# EAGLE design ESP32-C6_Qwiic_Micro (EAGLE 9.6.2)
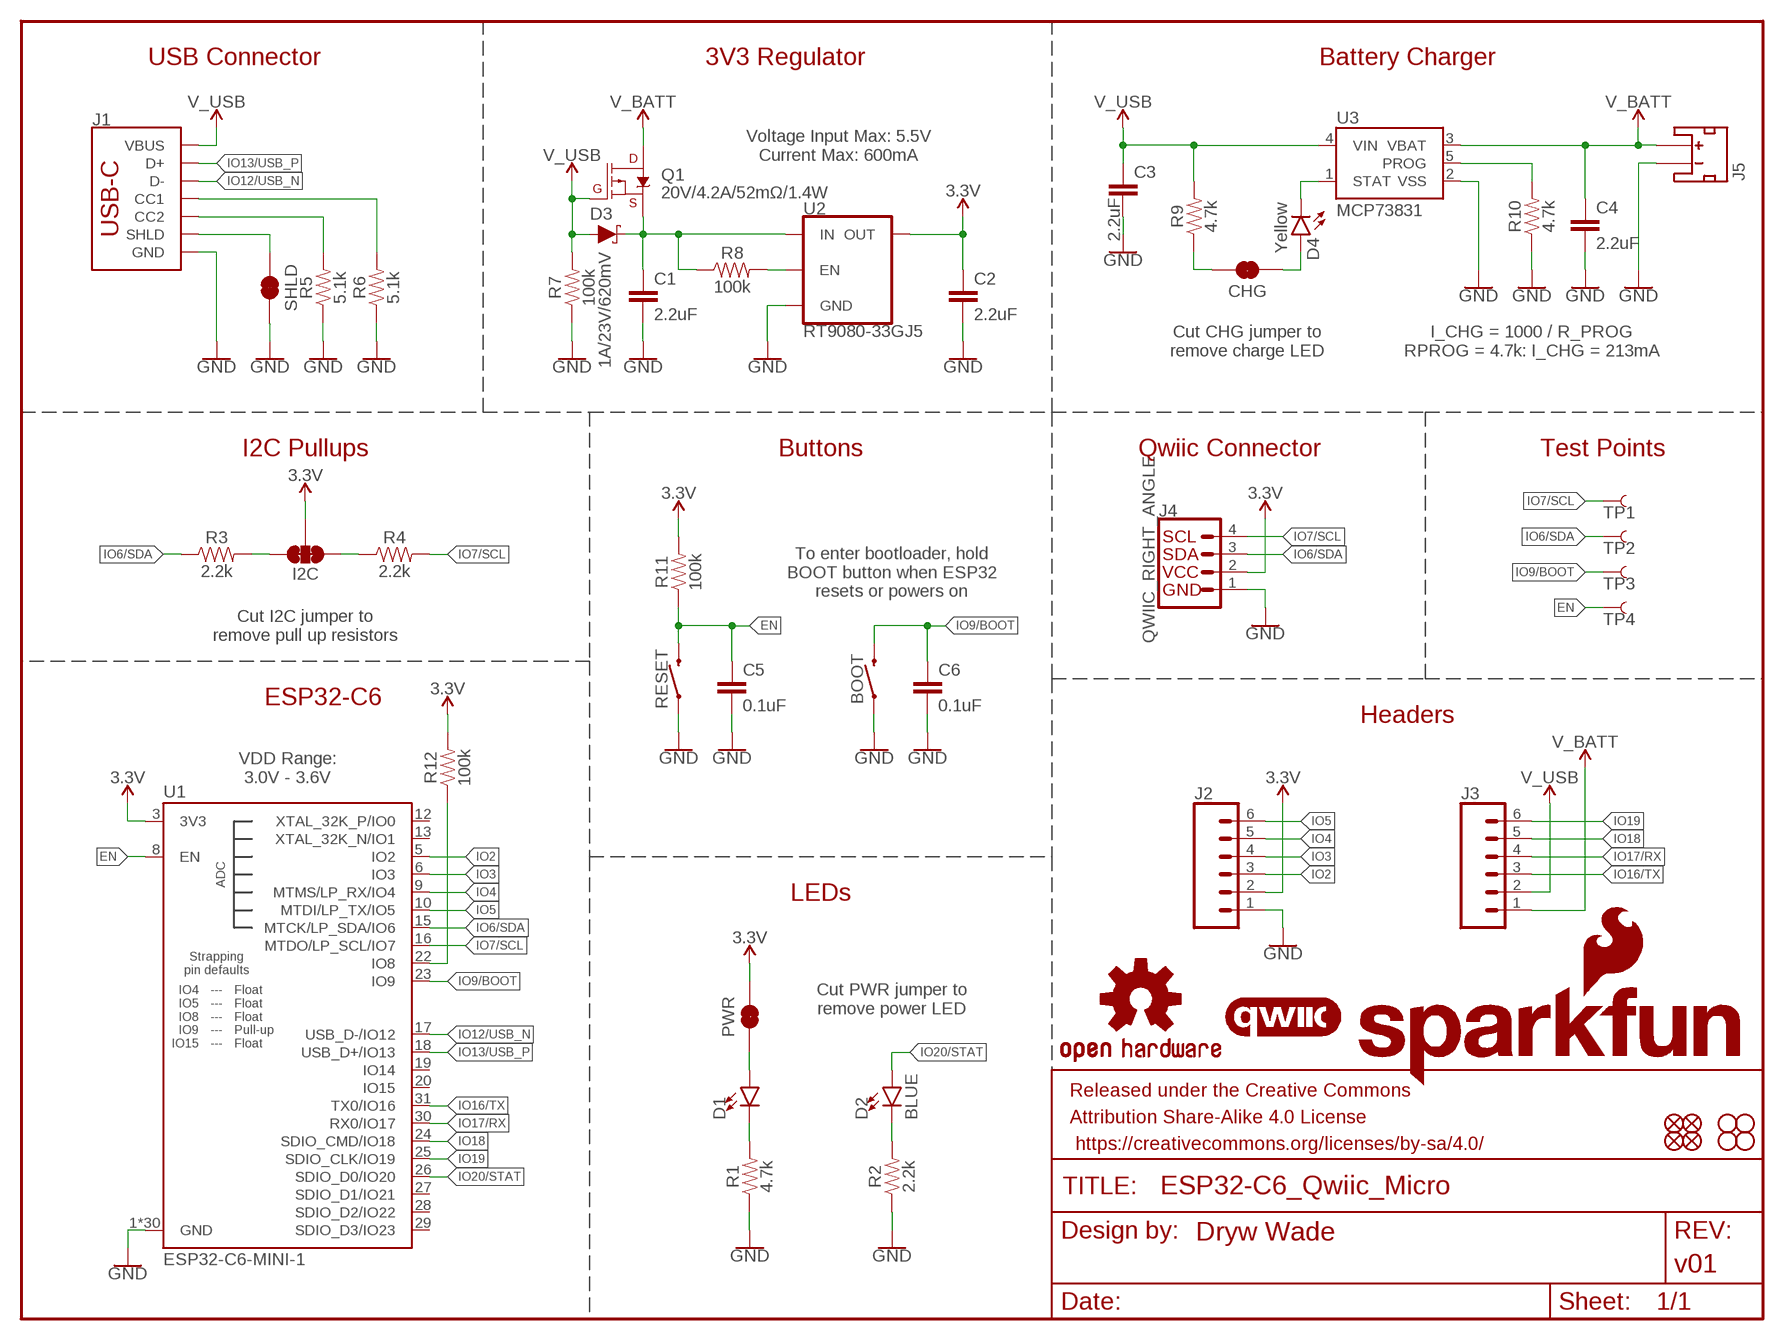
[diagram p0: schematic, sheet 1]

## Parts
BOOT  MOMENTARY-SWITCH-SPST-SMD-4.6X2.8MM  [TACTILE_SWITCH_SMD_4.6X2.8MM]
C1  2.2uF  2.2UF-0402_TIGHT-10V-10%-X5R  [0402-TIGHT]
C2  2.2uF  2.2UF-0402_TIGHT-10V-10%-X5R  [0402-TIGHT]
C3  2.2uF  2.2UF-0402_TIGHT-10V-10%-X5R  [0402-TIGHT]
C4  2.2uF  2.2UF-0402_TIGHT-10V-10%-X5R  [0402-TIGHT]
C5  0.1uF  0.1UF-0402T-6.3V-10%-X7R  [0402-TIGHT]
C6  0.1uF  0.1UF-0402T-6.3V-10%-X7R  [0402-TIGHT]
CHG  JUMPER-SMT_2_NC_TRACE_SILK  [SMT-JUMPER_2_NC_TRACE_SILK]
D1  LED-RED_0603-KB  [LED-0603]
D2  BLUE  LED-BLUE0603  [LED-0603]
D3  1A/23V/620mV  DIODE-SCHOTTKY-BAT20J  [SOD-323]
D4  Yellow  LED-YELLOW0603  [LED-0603]
FD1  FIDUCIALUFIDUCIAL  [FIDUCIAL-MICRO]
FD2  FIDUCIALUFIDUCIAL  [FIDUCIAL-MICRO]
FD3  FIDUCIALUFIDUCIAL  [FIDUCIAL-MICRO]
FD4  FIDUCIALUFIDUCIAL  [FIDUCIAL-MICRO]
FRAME1  FRAME-LETTER  [CREATIVE_COMMONS]
H1  STAND-OFF  [STAND-OFF]
H2  STAND-OFF  [STAND-OFF]
H3  STAND-OFF  [STAND-OFF]
H4  STAND-OFF  [STAND-OFF]
I2C  JUMPER-SMT_3_2-NC_TRACE_SILK  [SMT-JUMPER_3_2-NC_TRACE_SILK]
J1  USB Female Type C Connector  USB_C_4-LAYER_PADS  [USB-C-16P_4LAYER-PADS]
J2  CONN_06NO_SILK_NO_POP  [1X06_NO_SILK]
J3  CONN_06NO_SILK_NO_POP  [1X06_NO_SILK]
J4  QWIIC_RIGHT_ANGLE  QWIIC_CONNECTORJS-1MM  [JST04_1MM_RA]
J5  JST_2MM_MALE  [JST-2-SMD]
LOGO1  SFE_LOGO_NAME_FLAMEBLANK  [BLANK]
LOGO2  OSHW-LOGOS  [OSHW-LOGO-S]
LOGO3  QWIIC_LOGO_3MM  [QWIIC_3MM]
PWR  JUMPER-SMT_2_NC_TRACE_SILK  [SMT-JUMPER_2_NC_TRACE_SILK]
Q1  20V/4.2A/52mΩ/1.4W  MOSFET_PCH-DMG2305UX-7  [SOT23-3]
R1  4.7k  4.7KOHM-0402T-1/16W-1%  [0402-TIGHT]
R2  2.2k  2.2KOHM-0402T-1/16W-1%  [0402-TIGHT]
R3  2.2k  2.2KOHM-0402T-1/16W-1%  [0402-TIGHT]
R4  2.2k  2.2KOHM-0402T-1/16W-1%  [0402-TIGHT]
R5  5.1k  5.1KOHM-0402T-1/16W-1%  [0402-TIGHT]
R6  5.1k  5.1KOHM-0402T-1/16W-1%  [0402-TIGHT]
R7  100k  100KOHM-0402T-1/16W-1%  [0402-TIGHT]
R8  100k  100KOHM-0402T-1/16W-1%  [0402-TIGHT]
R9  4.7k  4.7KOHM-0402T-1/16W-1%  [0402-TIGHT]
R10  4.7k  4.7KOHM-0402T-1/16W-1%  [0402-TIGHT]
R11  100k  100KOHM-0402T-1/16W-1%  [0402-TIGHT]
R12  100k  100KOHM-0402T-1/16W-1%  [0402-TIGHT]
RESET  MOMENTARY-SWITCH-SPST-SMD-4.6X2.8MM  [TACTILE_SWITCH_SMD_4.6X2.8MM]
SHLD  JUMPER-SMT_2_NC_TRACE_SILK  [SMT-JUMPER_2_NC_TRACE_SILK]
TP1  TEST-POINT3  [PAD.03X.03]
TP2  TEST-POINT3  [PAD.03X.03]
TP3  TEST-POINT3  [PAD.03X.03]
TP4  TEST-POINT3  [PAD.03X.03]
U1  ESP32-C6-MINI-1  [ESP32-C6-MINI-1]
U2  RT9080-33GJ5  V_REG_RT9080  [SOT23-5]
U3  MCP73831  [SOT23-5]

## Nets
3.3V: C2.1 I2C.2 J2.2 J4.2 PWR.2 R11.2 R12.2 U1.3(3V3) U2.5(OUT)
EN: C5.1 R11.1 RESET.3 RESET.4 TP4.1 U1.8(EN)
GND: BOOT.1 BOOT.2 C1.2 C2.2 C3.2 C4.2 C5.2 C6.2 J1.GND J1.GND2(GND) J2.1 J4.1 J5.1(-) R1.1 R2.1 R5.1 R6.1 R7.1 R10.1 RESET.1 RESET.2 SHLD.2 U1.1(GND) U1.2(GND) U1.11(GND) U1.14(GND) U1.36(GND) U1.37(GND) U1.38(GND) U1.39(GND) U1.40(GND) U1.41(GND) U1.42(GND) U1.43(GND) U1.44(GND) U1.45(GND) U1.46(GND) U1.47(GND) U1.48(GND) U1.49.1(GND) U1.49.2(GND) U1.49.3(GND) U1.49.4(GND) U1.49.5(GND) U1.49.6(GND) U1.49.7(GND) U1.49.8(GND) U1.49.9(GND) U1.50(GND) U1.51(GND) U1.52(GND) U1.53(GND) U2.2(GND) U3.2(VSS)
IO2: J2.3 U1.5(IO2)
IO3: J2.4 U1.6(IO3)
IO4: J2.5 U1.9(MTMS/LP_RX/IO4)
IO5: J2.6 U1.10(MTDI/LP_TX/IO5)
IO6/SDA: J4.3 R3.1 TP2.1 U1.15(MTCK/LP_SDA/IO6)
IO7/SCL: J4.4 R4.2 TP1.1 U1.16(MTDO/LP_SCL/IO7)
IO9/BOOT: BOOT.3 BOOT.4 C6.1 TP3.1 U1.23(IO9)
IO12/USB_N: J1.A7(D-) J1.B7(D-) U1.17(USB_D-/IO12)
IO13/USB_P: J1.A6(D+) J1.B6(D+) U1.18(USB_D+/IO13)
IO16/TX: J3.3 U1.31(TX0/IO16)
IO17/RX: J3.4 U1.30(RX0/IO17)
IO18: J3.5 U1.24(SDIO_CMD/IO18)
IO19: J3.6 U1.25(SDIO_CLK/IO19)
IO20/STAT: D2.A U1.26(SDIO_D0/IO20)
N$1: D1.C R1.2
N$2: D1.A PWR.1
N$3: D2.C R2.2
N$4: I2C.3 R3.2
N$5: I2C.1 R4.1
N$6: R8.2 U2.3(EN)
N$7: J1.B5(CC2) R5.2
N$8: J1.A5(CC1) R6.2
N$9: C1.1 D3.C Q1.2(S) R8.1 U2.1(IN)
N$10: D4.C U3.1(STAT)
N$11: CHG.1 D4.A
N$12: CHG.2 R9.1
N$13: R10.2 U3.5(PROG)
N$14: R12.1 U1.22(IO8)
SHLD: J1.SHLD1(SHLD) J1.SHLD2(SHLD) J1.SHLD3(SHLD) J1.SHLD4(SHLD) SHLD.1
V_BATT: C4.1 J3.1 J5.2(+) Q1.3(D) U3.3(VBAT)
V_USB: C3.1 D3.A J1.VBUS1(VBUS) J1.VBUS2(VBUS) J3.2 Q1.1(G) R7.2 R9.2 U3.4(VIN)
Unconnected: J5.NC1(PAD1) J5.NC2(PAD2) U1.12(XTAL_32K_P/IO0) U1.13(XTAL_32K_N/IO1) U1.19(IO14) U1.20(IO15) U1.27(SDIO_D1/IO21) U1.28(SDIO_D2/IO22) U1.29(SDIO_D3/IO23)

## Notes on the sheet
- USB Connector | 3V3 Regulator | Battery Charger
- Voltage Input Max: 5.5V
  Current Max: 600mA
- Cut CHG jumper to
  remove charge LED
- I_CHG = 1000 / R_PROG
  RPROG = 4.7k: I_CHG = 213mA
- I2C Pullups | Buttons | Qwiic Connector | Test Points
- To enter bootloader, hold
  BOOT button when ESP32
  resets or powers on
- Cut I2C jumper to
  remove pull up resistors
- ESP32-C6
- Headers
- VDD Range:
  3.0V - 3.6V
- LEDs
- Cut PWR jumper to
  remove power LED

## Library data of the parts
BOOT RESET = SparkFun-Switches:MOMENTARY-SWITCH-SPST: Momentary Switch (Pushbutton) - SPST Normally-open (NO) SPST momentary switches (buttons, pushbuttons). Variants PTH-12MM - 12mm square, through-hole Momentary Pushbutton Switch - 12mm Square <https://www.sparkfun.com/products/9190> (COM-09190) PTH-6.0MM, PTH-6.0MM-KIT - 6.0mm square, through-hole Mini Pushbutton Switch <https://www.sparkfun.com/products/97> (COM-00097) KIT package intended for soldering kit's - only one side of pads' copper is exposed. PTH-RIGHT-ANGLE-KIT - Right-angle, through-hole Right Angle Tactile Button <https://www.sparkfun.com/products/10791> - Used on SparkFun BigTime Watch Kit <https://www.sparkfun.com/products/11734> SMD-12MM - 12mm square, surface-mount Tactile Button - SMD (12mm) <https://www.sparkfun.com/products/12993> (COM-12993) Used on SparkFun PicoBoard <https://www.sparkfun.com/products/11888> SMD-4.5MM - 4.5mm Square Trackball Switch Used on SparkFun Blackberry Trackballer Breakout <https://www.sparkfun.com/products/13169> SMD-4.6MMX2.8MM - 4.60mm x 2.80mm, surface mount Used on SparkFun Pro Micro - RP2040 <https://www.sparkfun.com/products/17717> SMD-5.2MM, SMD-5.2-REDUNDANT - 5.2mm square, surface-mount Mini Pushbutton Switch - SMD <https://www.sparkfun.com/products/8720> (COM-08720) Used on Arduino Pro Mini <https://www.sparkfun.com/products/11114> REDUNDANT package connects both switch circuits together SMD-6.0X3.5MM - 6.0 x 3.5mm, surface mount Momentary Reset Switch SMD <https://www.sparkfun.com/products/8229> (COM-08229) SMD-6.2MM-TALL - 6.2mm square, surface mount Tactile Button - SMD (6mm) <https://www.sparkfun.com/products/12992> Used on SparkFun Digital Sandbox <https://www.sparkfun.com/products/12651> SMD-RIGHT-ANGLE - Right-angle, surface mount Used on SparkFun Block for Intel® Edison - Arduino <https://www.sparkfun.com/products/13036>; PROD_ID: SWCH-15606
C1-C4 = SparkFun-Capacitors:2.2UF: 2.2µF ceramic capacitors A capacitor is a passive two-terminal electrical component used to store electrical energy temporarily in an electric field.; PROD_ID: CAP-14232
C5 C6 = SparkFun-Capacitors:0.1UF: 0.1µF ceramic capacitors A capacitor is a passive two-terminal electrical component used to store electrical energy temporarily in an electric field.; PROD_ID: CAP-14993
CHG PWR SHLD = SparkFun-Jumpers:JUMPER-SMT_2_NC_TRACE: Normally closed trace jumper This jumper has a trace between two pads so it's normally closed (NC). Use a razor knife to open the connection. For best results follow the IPC guidelines for cutting traces: Cutout at least 0.063 mm (0.005 in). Remove all loose material to clean up the cut area. Seal the cut with an approved epoxy. Reapply solder to reclose the connection.
D1 = SparkFun-LED:LED-RED: Red SMD LED Used in manufacturing of most products at SparkFun Packages: 0603 - KB - KingBright (DIO-17976) SMD 0603 package [Datasheet] <https://www.kingbrightusa.com/images/catalog/SPEC/APT1608SURCK.pdf> 0603 - (DIO-00819, has gone EOL) SMD 0603 package 0603 SMART - SMD 0603 SMART package ( more efficient and expensive)[Product Link] <http://www.osram-os.com/Graphics/XPic2/00077099_0.pdf> 1206 - SMD1206 package [Product Link] <https://www.sparkfun.com/datasheets/DevTools/LilyPad/Q150OVS4.pdff> SparkFun Products: Pro Mini 328 -5V <https://www.sparkfun.com/products/821> RedBoard <https://www.sparkfun.com/products/12757> IOIO-OTG <https://www.sparkfun.com/products/13613>; PROD_ID: DIO-17976
D2 = SparkFun-LED:LED-BLUE: Blue SMD LED Used in manufacturing of various products at SparkFun Packages: 0603 - SMD 0603 package [Product Link] <http://www.digikey.com/product-detail/en/SMLE12BC7TT86/511-1589-2-ND/1641808> 1206 - SMD1206 package [Product Link] <http://www.digikey.com/product-detail/en/lite-on-inc/LTST-C150TBKT/160-1643-1-ND/573584> SparkFun Products: ESP8266 Thing-Dev Board <https://www.sparkfun.com/products/13711> RedBoard <https://www.sparkfun.com/products/12757>; PROD_ID: DIO-08575
D3 = SparkFun-DiscreteSemi:DIODE-SCHOTTKY: Schottky diode A Schottky diode is a semiconductor diode which has a low forward voltage drop and a very fast switching action.; PROD_ID: DIO-11623
D4 = SparkFun-LED:LED-YELLOW: Yellow SMD LED Used in manufacturing several products at SparkFun. Packages: 0603 - SMD 0603 package[Product Link] <http://www.kingbrightusa.com/product.asp?catalog_name=LED&product_id=APT1608SYCK> 0603 -SMART - SMART SMD 0603 package (more efficient/more expensive) [Product Link] <http://www.osram-os.com/osram_os/en/products/product-catalog/led-light-emitting-diodes/smartled-0603/ly-l29k/index.jsp> LilyPad - SMD1206 package[Product Datasheet] <https://www.sparkfun.com/datasheets/DevTools/LilyPad/Q150YUS4.pdf> SparkFun Products: Blynk Board <https://www.sparkfun.com/products/13794> IOIO-OTG <https://www.sparkfun.com/products/13613> XBee Explorer Serial <https://www.sparkfun.com/products/13225>; PROD_ID: DIO-09003
FD1-FD4 = SparkFun-Aesthetics:FIDUCIAL: Fiducial Alignment Points Point-of-reference for pick-and-place machines and other optical instruments.
FRAME1 = SparkFun-Aesthetics:FRAME-LETTER: Schematic Frame - Letter Standard 8.5x11 US Letter frame; DESIGNER: Dryw Wade; REV: v01
H1-H4 = SparkFun-Hardware:STAND-OFF: Stand Off Drill holes for mechanically mounting via screws, standoffs, etc. Note: Use the keepout ring to avoid running the screw head into surrounding components. Variant Overviews STAND-OFF - Mechanical footprint for a #4 phillips button head screw. STAND-OFF-TIGHT - Mechanical footprint for a #4 phillips button head screw, Example SparkFun Products Screw - Phillips Head (1/4", 4-40, 10 pack) <https://www.sparkfun.com/products/10453> (PRT-10453) Screw - Phillips Head (1/2", 4-40, 10 pack) <https://www.sparkfun.com/products/10452> (PRT-10452) Screw - Phillips Head (3/4", 4-40, 10 pack) <https://www.sparkfun.com/products/10451> (PRT-10451) Screw - Phillips Head (1", 4-40, 10 pack) <https://www.sparkfun.com/products/10450> (PRT-10450)
I2C = SparkFun-Jumpers:JUMPER-SMT_3_2-NC_TRACE: Normally closed trace jumper (2 of 2 connections) This jumper has a trace between all three pads so they are normally closed (NC). Use a razor knife to open the connection(s). For best results follow the IPC guidelines for cutting traces: Cutout at least 0.063 mm (0.005 in). Remove all loose material to clean up the cut area. Seal the cut with an approved epoxy. Reapply solder to reclose the connection(s).
J1 = SparkFun-Connectors:USB_C: USB Type C 16Pin Connector Super Speed pins not available on the 16-pin purely SMD connector so this part is best for USB 2.0 implementations. D1 and D2 are tied together enabling D+/- no matter which way the cable is plugged into the connector. The two channel configuration pins (CC1/2) are exposed. These are normally connected to ground via 5.1k resistors but can be reconfigured for high current/high power applications. **4-LAYER BOARD WARNING!!** If designing 4-layer board, make sure to select the variant _4-LAYER-ISOLATED. The linked footprint (USB-C-16-4LAYER-ISOLATED) includes some very necessary cutout polygons in the inner layers (2 and 15). This prevents the PTH mounting shield legs on the USB connector from electrically connecting any other polygons on the inner layers (usually VCC and GND).; PROD_ID: CONN-14122
J2 J3 = SparkFun-Connectors:CONN_06: Multi connection point. Often used as Generic Header-pin footprint for 0.1 inch spaced/style header connections On any of the 0.1 inch spaced packages, you can populate with these: Break Away Headers - Straight <https://www.sparkfun.com/products/116> (PRT-00116) Break Away Male Headers - Right Angle <https://www.sparkfun.com/products/553> (PRT-00553) Female Headers <https://www.sparkfun.com/products/115> (PRT-00115) Break Away Headers - Machine Pin <https://www.sparkfun.com/products/117> (PRT-00117) Break Away Female Headers - Swiss Machine Pin <https://www.sparkfun.com/products/743> (PRT-00743) Arduino Stackable Header - 6 Pin <https://www.sparkfun.com/products/9280> (PRT-09280) Screw Terminals 2.54mm Pitch (6-Pin) <https://www.sparkfun.com/products/16499> (PRT-16499) For SCREWTERMINALS and SPRING TERMINALS visit here: Screw Terimnals on SparkFun.com <https://www.sparkfun.com/search/results?term=Screw+Terminals> (5mm/3.5mm/2.54mm spacing) This device is also useful as a general connection point to wire up your design to another part of your project. Our various solder wires solder well into these plated through hole pads. Hook-Up Wire - Assortment (Stranded, 22 AWG) <https://www.sparkfun.com/products/11375> (PRT-11375) Hook-Up Wire - Assortment (Solid Core, 22 AWG) <https://www.sparkfun.com/products/11367> (PRT-11367) View the entire wire category on our website here <https://www.sparkfun.com/categories/141>
J4 = SparkFun-Connectors:QWIIC_CONNECTOR: SparkFun I2C Standard Qwiic Connector An SMD 1mm pitch JST connector makes it easy and quick (get it? Qwiic?) to connect I2C devices to each other. The Qwiic system <http://www.sparkfun.com/qwiic> enables fast and solderless connection between popular platforms and various sensors and actuators. We carry 200mm <https://www.sparkfun.com/products/14204>, 100mm <https://www.sparkfun.com/products/14205>, 50mm <https://www.sparkfun.com/products/14206>, and breadboard friendly <https://www.sparkfun.com/products/14207> Qwiic cables. We also offer 10 pcs strips <https://www.sparkfun.com/products/14323> the SMD connectors.; PROD_ID: CONN-13694
J5 = SparkFun-Connectors:JST_2MM_MALE: JST 2MM MALE RA CONNECTOR Two pin, compact surface mount connector. Commonly used as a battery input connection point. We really like the solid locking feeling and high current rating on these small connectors. We use these all the time as battery connectors. Mates to single-cell LiPo batteries. Here is the connector we sell at SparkFun: JST Right Angle Connector - White <https://www.sparkfun.com/products/8612> (PRT-08612) Datasheet <http://www.sparkfun.com/datasheets/Prototyping/Connectors/JST-Horizontal.pdf> It was used on these SparkFun products: SparkFun MOSFET Power Controller <https://www.sparkfun.com/products/11214> (PRT-11214) SparkFun Battery Babysitter - LiPo Battery Manager <https://www.sparkfun.com/products/13777> (PRT-13777) And many, many others that required a lipo battery connection.; PROD_ID: CONN-11443; SF_ID: PRT-08612
LOGO1 = SparkFun-Aesthetics:SFE_LOGO_NAME_FLAME: SparkFun Font Logo w/ Flame This is the SparkFun full logo. The logo on the schematic will always be the same size; the package variant is the height of the flame part of the logo. Default layer for the logo on the board is tSilk.
LOGO2 = SparkFun-Aesthetics:OSHW-LOGO: Open-Source Hardware (OSHW) Logo This logo indicates the piece of hardware it is found on incorporates a OSHW license and/or adheres to the definition of open source hardware found here: http://freedomdefined.org/OSHW
LOGO3 = SparkFun-Aesthetics:QWIIC_LOGO: Qwiic Logos for placement on schematic and PCB. The 5.5mm silk logo is best for placing next to Qwiic connector.
Q1 = SparkFun-DiscreteSemi:MOSFET_PCH: P-channel MOSFETs Voltage controlled devices that allow control of high current outputs. SparkFun Products: SparkFun ESP32 Thing <https://www.sparkfun.com/products/13907> SparkFun ESP8266 Thing <https://www.sparkfun.com/products/13231> SparkFun Pi Servo HAT V2 <https://www.sparkfun.com/products/15316> DMG2305UX-7 (20V/4.2A/SOT23-3); PROD_ID: TRANS-14388
R1 R9 R10 = SparkFun-Resistors:4.7KOHM: 4.7kΩ resistor A resistor is a passive two-terminal electrical component that implements electrical resistance as a circuit element. Resistors act to reduce current flow, and, at the same time, act to lower voltage levels within circuits. - Wikipedia; PROD_ID: RES-15343
R2-R4 = SparkFun-Resistors:2.2KOHM: 2.2kΩ resistor A resistor is a passive two-terminal electrical component that implements electrical resistance as a circuit element. Resistors act to reduce current flow, and, at the same time, act to lower voltage levels within circuits. - Wikipedia; PROD_ID: RES-14341
R5 R6 = SparkFun-Resistors:5.1KOHM; PROD_ID: RES-14340
R7 R8 R11 R12 = SparkFun-Resistors:100KOHM: 100kΩ resistor A resistor is a passive two-terminal electrical component that implements electrical resistance as a circuit element. Resistors act to reduce current flow, and, at the same time, act to lower voltage levels within circuits. - Wikipedia; PROD_ID: RES-13495
TP1-TP4 = SparkFun-Connectors:TEST-POINT: SparkFun Test Points Bare copper test points for troubleshooting or In-Circuit-Testing. These are used by our Production team for verifying production board runs using pogo-pins on test beds. SparkFun Products: SparkFun LSM9DS1 Breakout <https://www.sparkfun.com/products/13284> SparkFun PSOC <https://www.sparkfun.com/products/13714> SparkFun Load Cell Amplifier <https://www.sparkfun.com/products/13879>
U1 = ESP32-C6-MINI-1:ESP32-C6-MINI-1; PROD_ID: IC-19033
U2 = SparkFun-IC-Power:V_REG_RT9080; PROD_ID: VREG-19034
U3 = SparkFun-IC-Power:MCP73831: MCP73831T Li-Ion, Li-Pol Controller Miniature single cell, fully integrated Li-Ion, Li-polymer charge management controller Datasheet <http://ww1.microchip.com/downloads/en/DeviceDoc/20001984g.pdf> SparkFun Products: SparkFun ESP32 Thing <https://www.sparkfun.com/products/13907> SparkFun 9DoF Razor IMU M0 <https://www.sparkfun.com/products/14001>; PROD_ID: IC-09995

## Board
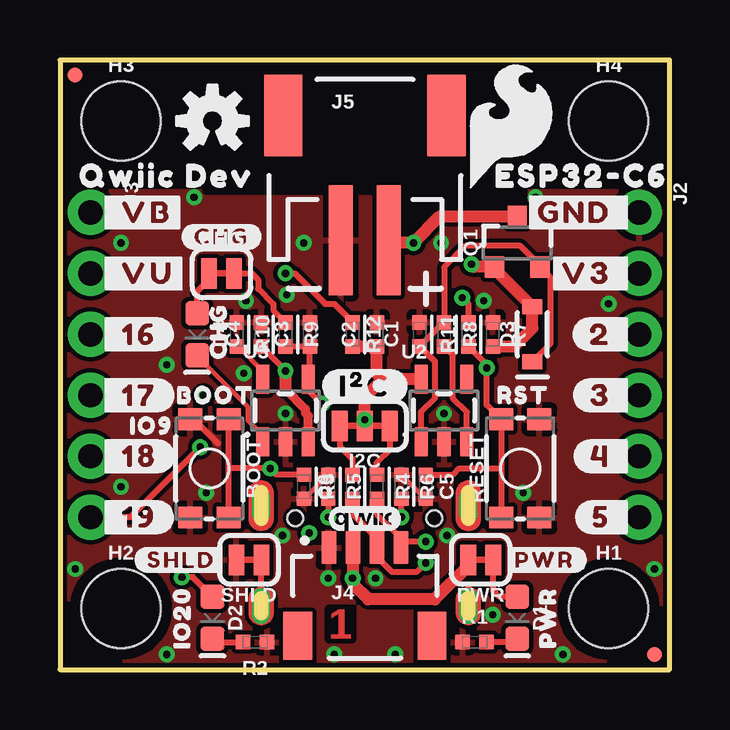
[diagram p1: board, top side]
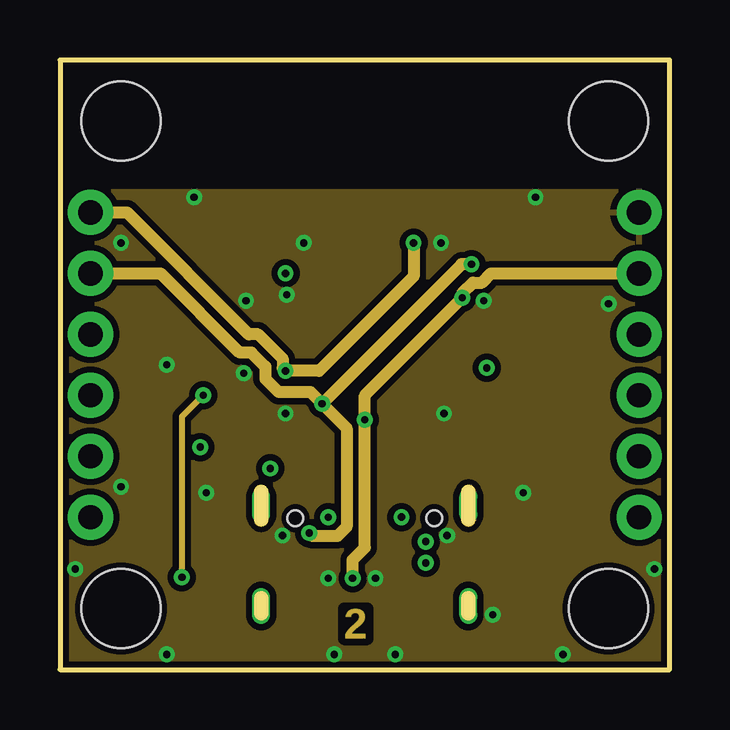
[diagram p2: board, inner layer Route2]
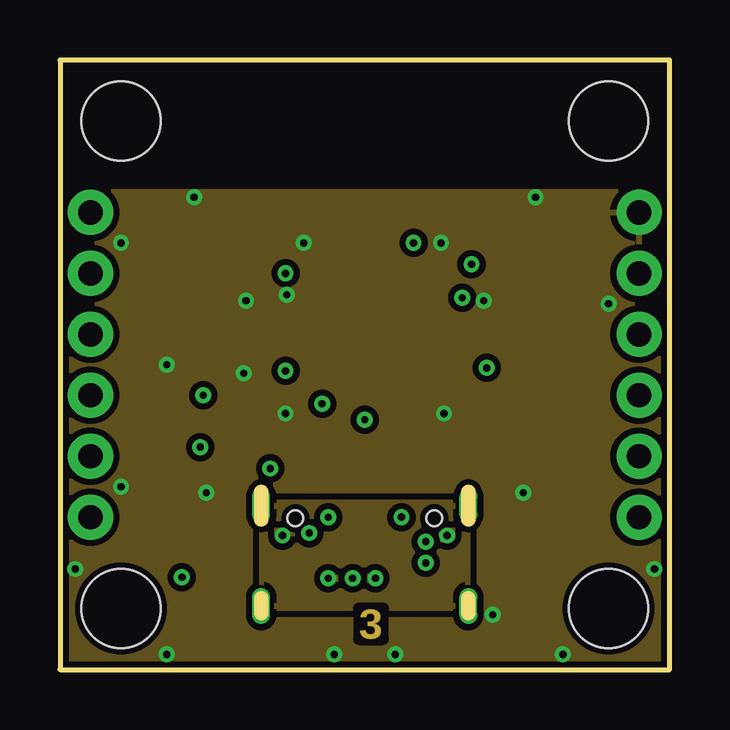
[diagram p3: board, inner layer Route15]
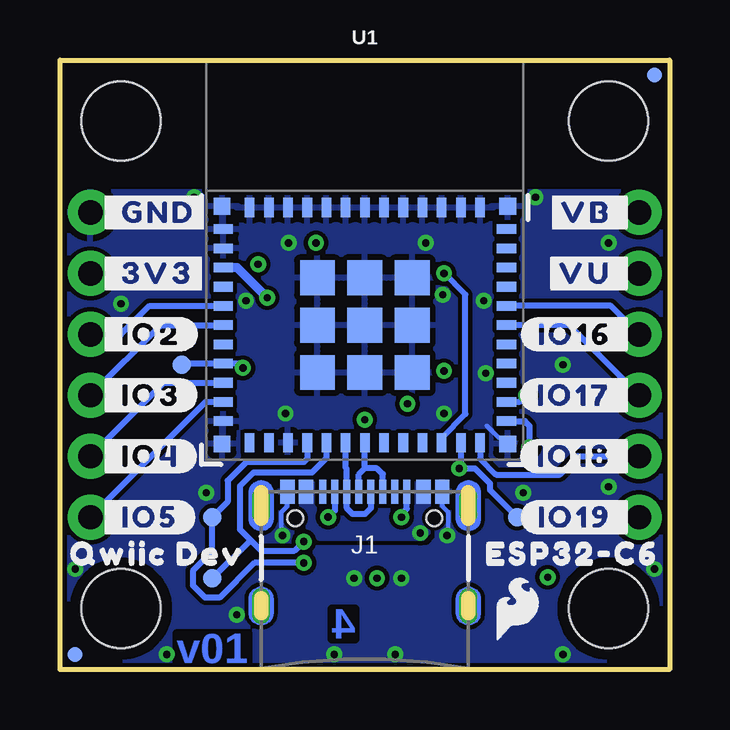
[diagram p4: board, bottom side, seen from below]

Size 25.4 x 25.4 mm. Coordinates in mm from the lower left corner, seen from the top.
Outline: 0,0 25.4,0 25.4,25.4 0,25.4 0,0
Copper layers (1+2*15+16): Top 0.035559375mm / dielectric 0.47751875mm / Route2 0.035559375mm / dielectric 0.47751875mm / Route15 0.035559375mm / dielectric 0.47751875mm / Bottom 0.035559375mm
Design rules "SparkFun-4-Layer-General-JLCPCB": minimum track width 7mil, minimum drill 12mil, track to track 7mil, track to pad 7mil, pad to pad 7mil, via to via 7mil, smd to smd 7mil, copper to edge 7mil, drill to drill 7mil, minimum pad ring 7mil, minimum via ring 7mil, stop-mask expansion 3mil, vias tented up to drill 25mil, thermal gap 10mil
tRestrict: area 14.1,8.6 to 14.4,8.9; area 11,8.6 to 11.3,8.9; area 10.9,14.4 to 11.2,14.6; area 19.1,19.6 to 19.3,19.8
bRestrict: area 9.4,8.1 to 9.7,8.4

### Footprints (pad centres in the part's own frame; a part is rotated, then mirrored left to right if it is on the bottom)
TACTILE_SWITCH_SMD_4.6X2.8MM = smd 0.9 x 1: 1 -2.05,-0.8; 2 2.05,-0.8; 3 2.05,0.8; 4 -2.05,0.8
0402-TIGHT = smd 0.6 x 0.6: 1 -0.5,0; 2 0.5,0
SMT-JUMPER_2_NC_TRACE_SILK = smd 0.66 x 1.27: 1 -0.521,0; 2 0.521,0
LED-0603 = smd 1 x 1: A -0.877,0; C 0.877,0
SOD-323 = smd 0.63 x 0.83: A 1.15,0; C -1.15,0
FIDUCIAL-MICRO = smd 0.635 x 0.635: 1 0,0
STAND-OFF = hole 3.302: 0,0
SMT-JUMPER_3_2-NC_TRACE_SILK = smd 0.66 x 1.27: 1 -1.041,0; 2 0,0; 3 1.041,0
USB-C-16P_4LAYER-PADS = smd 0.3 x 1: A5 -1.25,-0.34; A6 -0.25,-0.34; A7 0.25,-0.34; A8 1.25,-0.34; B5 1.75,-0.34; B6 0.75,-0.34; B7 -0.75,-0.34; B8 -1.75,-0.34 | smd 0.6 x 1: GND -3.225,-0.34; GND2 3.225,-0.34; VBUS1 -2.45,-0.34; VBUS2 2.45,-0.34 | drill 0.4 pad 0.6 long: SHLD1 -4.318,-0.915; SHLD2 4.318,-0.915; SHLD3 -4.318,-5.095; SHLD4 4.318,-5.095 | hole 0.65: -2.89,-1.445; 2.89,-1.445
1X06_NO_SILK = drill 1.016 pad 1.88: 1 0,0; 2 2.54,0; 3 5.08,0; 4 7.62,0; 5 10.16,0; 6 12.7,0
JST04_1MM_RA = smd 0.6 x 1.35: 1 -1.5,0; 2 -0.5,0; 3 0.5,0; 4 1.5,0 | smd 1.2 x 2: NC1 2.8,-3.675; NC2 -2.8,-3.675
JST-2-SMD = smd 1 x 4.6: 1 -1,-3.7; 2 1,-3.7 | smd 1.6 x 3.4: NC1 -3.4,1.5; NC2 3.4,1.5
SOT23-3 = smd 0.8 x 0.9: 1 -0.95,-1; 2 0.95,-1; 3 0,1.1
PAD.03X.03 = smd 0.762 x 0.762: 1 0,0
ESP32-C6-MINI-1 = smd 0.8 x 0.4: 1 -5.9,4; 2 -5.9,3.2; 3 -5.9,2.4; 4 -5.9,1.6; 5 -5.9,0.8; 6 -5.9,0; 7 -5.9,-0.8; 8 -5.9,-1.6; 9 -5.9,-2.4; 10 -5.9,-3.2; 11 -5.9,-4; 25 5.9,-4; 26 5.9,-3.2; 27 5.9,-2.4; 28 5.9,-1.6; 29 5.9,-0.8; 30 5.9,0; 31 5.9,0.8; 32 5.9,1.6; 33 5.9,2.4; 34 5.9,3.2; 35 5.9,4 | smd 0.4 x 0.8: 12 -4.8,-4.9; 13 -4,-4.9; 14 -3.2,-4.9; 15 -2.4,-4.9; 16 -1.6,-4.9; 17 -0.8,-4.9; 18 0,-4.9; 19 0.8,-4.9; 20 1.6,-4.9; 21 2.4,-4.9; 22 3.2,-4.9; 23 4,-4.9; 24 4.8,-4.9; 36 4.8,4.9; 37 4,4.9; 38 3.2,4.9; 39 2.4,4.9; 40 1.6,4.9; 41 0.8,4.9; 42 0,4.9; 43 -0.8,4.9; 44 -1.6,4.9; 45 -2.4,4.9; 46 -3.2,4.9; 47 -4,4.9; 48 -4.8,4.9 | smd 1.45 x 1.45: 49.1 -1.975,1.975; 49.2 -1.975,0; 49.3 -1.975,-1.975; 49.4 0,-1.975; 49.5 1.975,-1.975; 49.6 1.975,0; 49.7 1.975,1.975; 49.8 0,1.975; 49.9 0,0 | smd 0.7 x 0.7: 50 5.95,4.95; 51 5.95,-4.95; 52 -5.95,-4.95; 53 -5.95,4.95
SOT23-5 = smd 0.55 x 1.2: 1 -0.95,-1.3; 2 0,-1.3; 3 0.95,-1.3; 4 0.95,1.3; 5 -0.95,1.3

### Placement (x,y rotation side)
BOOT  6.22,8.38 270 top
C1  14.99,13.97 90 top
C2  13.21,13.97 90 top
C3  10.41,13.97 90 top
C4  8.38,13.97 90 top
C5  15.24,7.62 270 top
C6  10.16,7.62 270 top
CHG  6.73,16.51 0 top
D1  19.05,2.16 270 top
D2  6.35,2.16 270 top
D3  19.68,13.97 90 top
D4  5.71,13.97 270 top
FD1  0.64,24.77 0 bottom
FD2  0.64,24.77 0 top
FD3  24.77,0.64 0 bottom
FD4  24.77,0.64 0 top
FRAME1  -10.16,-25.4 0 top  (outside the outline)
H1  22.86,2.54 0 top
H2  2.54,2.54 0 top
H3  2.54,22.86 0 top
H4  22.86,22.86 0 top
I2C  12.7,10.16 180 top
J1  12.7,7.75 0 bottom
J2  24.13,19.05 270 top
J3  1.27,19.05 270 top
J4  12.7,5.08 0 top
J5  12.7,21.59 0 top
LOGO1  -8.89,-25.4 0 top  (outside the outline)
LOGO2  6.35,22.86 0 top
LOGO3  12.7,6.29 0 top
PWR  17.53,4.57 180 top
Q1  19.05,17.78 0 top
R1  17.27,1.14 0 top
R2  4.7k  [0402-TIGHT]  8.13,1.14 180 top
R3  12.19,7.62 90 top
R4  13.21,7.62 270 top
R5  11.18,7.62 270 top
R6  14.22,7.62 270 top
R7  18.03,13.97 270 top
R8  16,13.97 270 top
R9  9.4,13.97 270 top
R10  7.37,13.97 270 top
R11  17.02,13.97 90 top
R12  12.19,13.97 270 top
RESET  19.18,8.38 90 top
SHLD  7.87,4.57 180 top
TP1  19.05,3.81 0 bottom
TP2  19.05,6.35 0 bottom
TP3  6.35,6.35 0 bottom
TP4  20.32,12.7 0 bottom
U1  12.7,14.35 0 bottom
U2  16,10.79 0 top
U3  9.4,10.79 0 top
U$1  [#_GND#0]  23.88,19.05 0 bottom
U$2  [#_3V3#0]  23.88,16.51 0 bottom
U$3  [#V3_#0]  24,16.51 0 top
U$4  [IO200]  5.08,2.16 90 top
U$5  [#GND_#0]  24,19.05 0 top
U$6  [SFE_LOGO_FLAME_.2]  18.8,22.61 0 top
U$7  [#VU_#0]  1.4,16.51 0 bottom
U$8  [#_VB#0]  1.52,19.05 0 top
U$9  [QWIIC_DEV0]  21.34,4.83 0 bottom
U$10  [SFE_LOGO_FLAME_.1]  6.35,2.54 0 bottom
U$11  [ESP32#C633]  4.06,4.83 0 bottom
U$12  [ESP32#C633]  21.72,20.57 0 top
U$13  [#_IO5#0]  23.88,6.35 0 bottom
U$14  [#_IO4#0]  23.88,8.89 0 bottom
U$15  [#_IO3#0]  23.88,11.43 0 bottom
U$16  [#_IO2#0]  23.88,13.97 0 bottom
U$17  [#IO16_#0]  1.4,13.97 0 bottom
U$18  [#IO17_#0]  1.4,11.43 0 bottom
U$19  [#IO18_#0]  1.4,8.89 0 bottom
U$20  [#IO19_#0]  1.4,6.35 0 bottom
U$21  [#5_#0]  24,6.35 0 top
U$22  [#4_#0]  24,8.89 0 top
U$23  [#I�C#0]  12.7,11.81 0 top
U$24  [ORDERING_INSTRUCTIONS]  36.83,50.8 0 top  (outside the outline)
U$25  [QWIIC_DEV0]  4.45,20.57 0 top
U$26  [#PWR#0]  18.41,4.57 0 top
U$27  [#SHLD#0]  6.99,4.57 0 top
U$30  [PWR0]  20.32,2.16 90 top
U$31  [#CHG#0]  6.73,18.03 0 top
U$32  [CHG0]  6.6,14.1 90 top
U$33  [BOOT0]  6.48,11.43 0 top
U$34  [RST0]  19.3,11.43 0 top
U$35  [IO90]  3.81,10.16 0 top
U$36  [#VB_#0]  1.4,19.05 0 bottom
U$37  [#_VU#0]  1.52,16.51 0 top
U$38  [#3_#0]  24,11.43 0 top
U$39  [#2_#0]  24,13.97 0 top
U$40  [#_16#0]  1.52,13.97 0 top
U$41  [#_17#0]  1.52,11.43 0 top
U$42  [#_18#0]  1.52,8.89 0 top
U$43  [#_19#0]  1.52,6.35 0 top

### Tracks (layer width: path | path; a pad name or v marks a point on that pad's centre or on a via)
3.3V  (via drill 0.3)
  Top 0.254: PWR.2 17,4.3 | I2C.2 v12.7,10.41 | v16.76,15.49 17.02,15.24 R11.2 | v12.2,3.82 v12.19,3.81
  Top 0.508: 17,4.3 15.62,2.92 12.84,2.92 12.2,3.56 v12.2,3.82 J4.2 | U2.5 13.44,12.1 | 13.44,12.1 13.21,12.33 C2.1 R12.2 | v12.7,10.41 12.7,11.36 13.44,12.1
  Route2 0.508: v12.19,3.81 12.19,4.57 12.7,5.08 v12.7,10.41 12.7,11.43 v16.76,15.49 16.76,15.68 17.21,16.13 17.59,16.13 17.97,16.51 J2.2
  Bottom 0.381: v16.76,15.49 18.02,16.75 U1.3
EN  (via drill 0.3)
  Top 0.254: 18.38,8.38 RESET.3 17.78,11.03 v17.78,12.57 17.78,12.71 R11.1 | 18.38,8.38 RESET.4 | C5.1 16.38,8.12 16.64,8.38 18.38,8.38
  Bottom 0.254: v17.78,12.57 17.96,12.75 U1.8 20.27,12.75 TP4.1
GND  (via drill 0.3)
  Top 0.178: R5.1 10.18,7.12 C6.2 | R6.1 15.22,7.12 C5.2
  Top 0.254: BOOT.1 5.68,10.18 5.83,10.18 6.59,9.42
  Bottom 0.178: J1.GND2 9.47,6.8 9.22,6.55 9.22,5.64 v9.27,5.59 | J1.GND 15.93,6.8 16.18,6.55 16.18,5.64 v16.13,5.59 | U1.51 7,9.65 7.12,9.65 7.62,10.16
  other vias: 20.95,0.64 4.45,0.64 9.4,10.67 16,10.67 17.65,15.37 7.75,15.37 9.45,15.62 4.45,12.7 7.66,12.34 0.64,4.19 24.77,4.19 10.16,17.78 5.59,19.68 2.54,7.62 2.54,17.78 15.88,17.78 6.1,7.37 18.03,2.29 11.43,0.64 13.97,0.64 11.18,3.81 13.14,3.81 19.3,7.37 19.81,19.68 22.86,15.24
  pour Top (isolate 0.178): 0,0 25.4,0 25.4,19.94 0,19.94
  pour Route2 (isolate 0.254, rank 2): 25.4,0 0,0 0,19.94 25.4,19.94
  pour Bottom (isolate 0.178, rank 2): 25.4,0 0,0 0,19.94 25.4,19.94
  pour Route15 (isolate 0.254, rank 2): 25.4,0 0,0 0,19.94 25.4,19.94
IO2
  Bottom 0.254: J2.3 22.86,13.97 21.68,15.15 U1.5
IO3
  Bottom 0.254: J2.4 21.21,14.35 U1.6
IO4
  Bottom 0.254: J2.5 21.07,11.95 U1.9
IO5
  Bottom 0.254: J2.6 19.33,11.15 U1.10
IO6/SDA  (via drill 0.3)
  Top 0.254: R3.1 12.19,6.48 13.2,5.47 J4.3 13.2,4.7 13.84,4.06 14.86,4.06 v15.24,4.45
  Bottom 0.254: U1.15 15.1,8.78 15.24,8.64 17.64,8.64 18.41,7.87 18.41,6.99 TP2.1 19.05,4.93 19.86,4.12 19.86,3.5 19.36,3 18.75,3 17.3,4.45 v15.24,4.45
IO7/SCL  (via drill 0.3)
  Top 0.254: R4.2 13.21,6.48 14.2,5.49 J4.4 14.45,5.33 v15.24,5.33
  Bottom 0.254: U1.16 14.3,8.81 14.9,8.21 17.34,8.21 17.91,7.64 17.91,5.84 17.46,5.4 | v15.24,5.33 15.62,4.95 17.02,4.95 17.46,5.4 | TP1.1 17.46,5.4
IO9/BOOT  (via drill 0.3)
  Top 0.254: BOOT.3 7.02,8.38 | 7.02,8.38 BOOT.4 | C6.1 9.02,8.12 v8.76,8.37 v8.76,8.38 7.02,8.38
  Bottom 0.254: U1.23 8.7,8.45 v8.76,8.38 8.11,8.38 7.49,7.76 7.49,7.49 TP3.1
IO12/USB_N
  Bottom 0.254: U1.17 13.5,8.42 13.46,8.38 13.46,7.42 J1.B7 13.45,6.72 13.21,6.48 12.7,6.48 12.45,6.73 J1.A7
IO13/USB_P
  Bottom 0.254: J1.A6 12.95,8.13 12.7,8.38 | 12.7,8.38 U1.18 | J1.B6 11.95,8.14 12.19,8.38 12.7,8.38
IO16/TX
  Bottom 0.254: J3.3 2.45,15.15 U1.31
IO17/RX
  Bottom 0.254: J3.4 4.19,14.35 U1.30
IO18
  Bottom 0.254: U1.24 7.9,8.79 7.24,8.13 4.57,8.13 3.81,8.89 J3.5
IO19  (via drill 0.3)
  Top 0.254: v5.84,9.27 2.92,6.35 J3.6
  Bottom 0.254: U1.25 6.03,10.35 5.84,10.16 v5.84,9.27
IO20/STAT  (via drill 0.3)
  Top 0.254: D2.A 5.54,3.85 v5.08,3.85
  Route2 0.254: v5.97,11.43 5.08,10.54 v5.08,3.85
  Bottom 0.254: U1.26 6.25,11.15 v5.97,11.43
N$1
  Top 0.254: D1.C 18.91,1.14 R1.2
N$2
  Top 0.254: D1.A 18.29,3.04 18.05,3.28 PWR.1
N$3
  Top 0.254: D2.C 6.49,1.14 R2.2
N$4
  Top 0.254: R3.2 12.19,8.76 11.66,9.3 I2C.3
N$5
  Top 0.254: R4.1 13.21,8.64 13.74,9.17 I2C.1
N$6
  Top 0.254: R8.2 16.37,13.1 16.37,11.31 16.95,10.73 U2.3
N$7  (via drill 0.3)
  Top 0.254: R5.2 v11.18,6.35
  Bottom 0.254: v11.18,6.35 11.18,6.48 10.95,6.7 J1.B5
N$8  (via drill 0.3)
  Top 0.254: v14.23,6.36 R6.2
  Bottom 0.254: v14.23,6.36 13.95,6.63 J1.A5
N$9
  Top 0.254: D3.C 20.45,13.58 20.45,16.33 Q1.2 20,16.83 19.18,17.65 16.89,17.65 16,16.76 R8.1 15.99,14.47 C1.1 15.63,12.82 15.63,11.31 15.05,10.73 U2.1
N$10
  Top 0.178: U3.1 8.45,9.75 7.81,10.38 7.81,10.96 5.71,13.06 D4.C
N$11
  Top 0.254: D4.A 5.71,15.76 6.21,16.26 CHG.1
N$12
  Top 0.254: CHG.2 7.99,16.51 8.26,16.25 8.26,15.87 8.89,15.23 8.89,14.98 R9.1
N$13
  Top 0.178: 8.45,12.44 7.42,13.47 R10.2
  Top 0.254: U3.5 8.45,12.44
N$14  (via drill 0.3)
  Top 0.254: v9.4,16.51 9.78,16.51 11.05,15.24 11.42,15.24 R12.1
  Bottom 0.254: U1.22 9.5,9.67 8.51,10.66 8.51,15.62 v9.4,16.51
SHLD
  Top 0.254: J1.SHLD4 SHLD.1
  pour Route15 (isolate 0.254): 17.02,2.54 8.38,2.54 8.38,6.99 17.02,6.99
V_BATT  (via drill 0.3)
  Top 0.254: C4.1 v9.4,12.45
  Top 0.381: U3.3 10.35,10.57 10.22,10.7 10.22,10.85 9.4,11.68
  Top 0.508: 9.4,11.68 v9.4,12.45 | J5.2 13.81,17.78 v14.73,17.78 15.83,18.88 Q1.3
  Route2 0.508: v14.73,17.78 14.73,16.38 10.79,12.45 v9.4,12.45 9.27,12.57 9.27,12.95 8.26,13.97 7.87,13.97 2.79,19.05 J3.1
V_USB  (via drill 0.3)
  Top 0.254: R9.2 C3.1 10.41,12.16 U3.4 10.35,11.65 v10.92,11.07
  Top 0.508: v17.14,16.89 17.26,16.78 Q1.1 18.1,16.7 D3.A 19.68,14.22 18.93,13.47 R7.2
  Route2 0.508: v17.14,16.89 16.74,16.89 v10.92,11.07 | v10.39,5.69 10.52,5.56 11.56,5.56 11.94,5.94 11.94,10.06 v10.92,11.07 | v10.92,11.07 10.44,11.56 9.12,11.56 8.56,12.12 8.56,12.62 7.98,13.21 7.49,13.21 4.19,16.51 J3.2
  pour Bottom (isolate 0.178, no thermals): 15.37,7.75 15.37,6.22 14.61,5.46 10.29,5.46 10.03,5.71 10.03,7.75

### Text on the board
Top: 1
Route2: 2
Route15: 3
Bottom: 4 | v01
Measures: Units: inches
tDocu: 4-layer / Board thickness: 1.6mm / Soldermask: Red / Silkscreen: White / Surface Finish: Lead-Free HASL | Dryw Wade